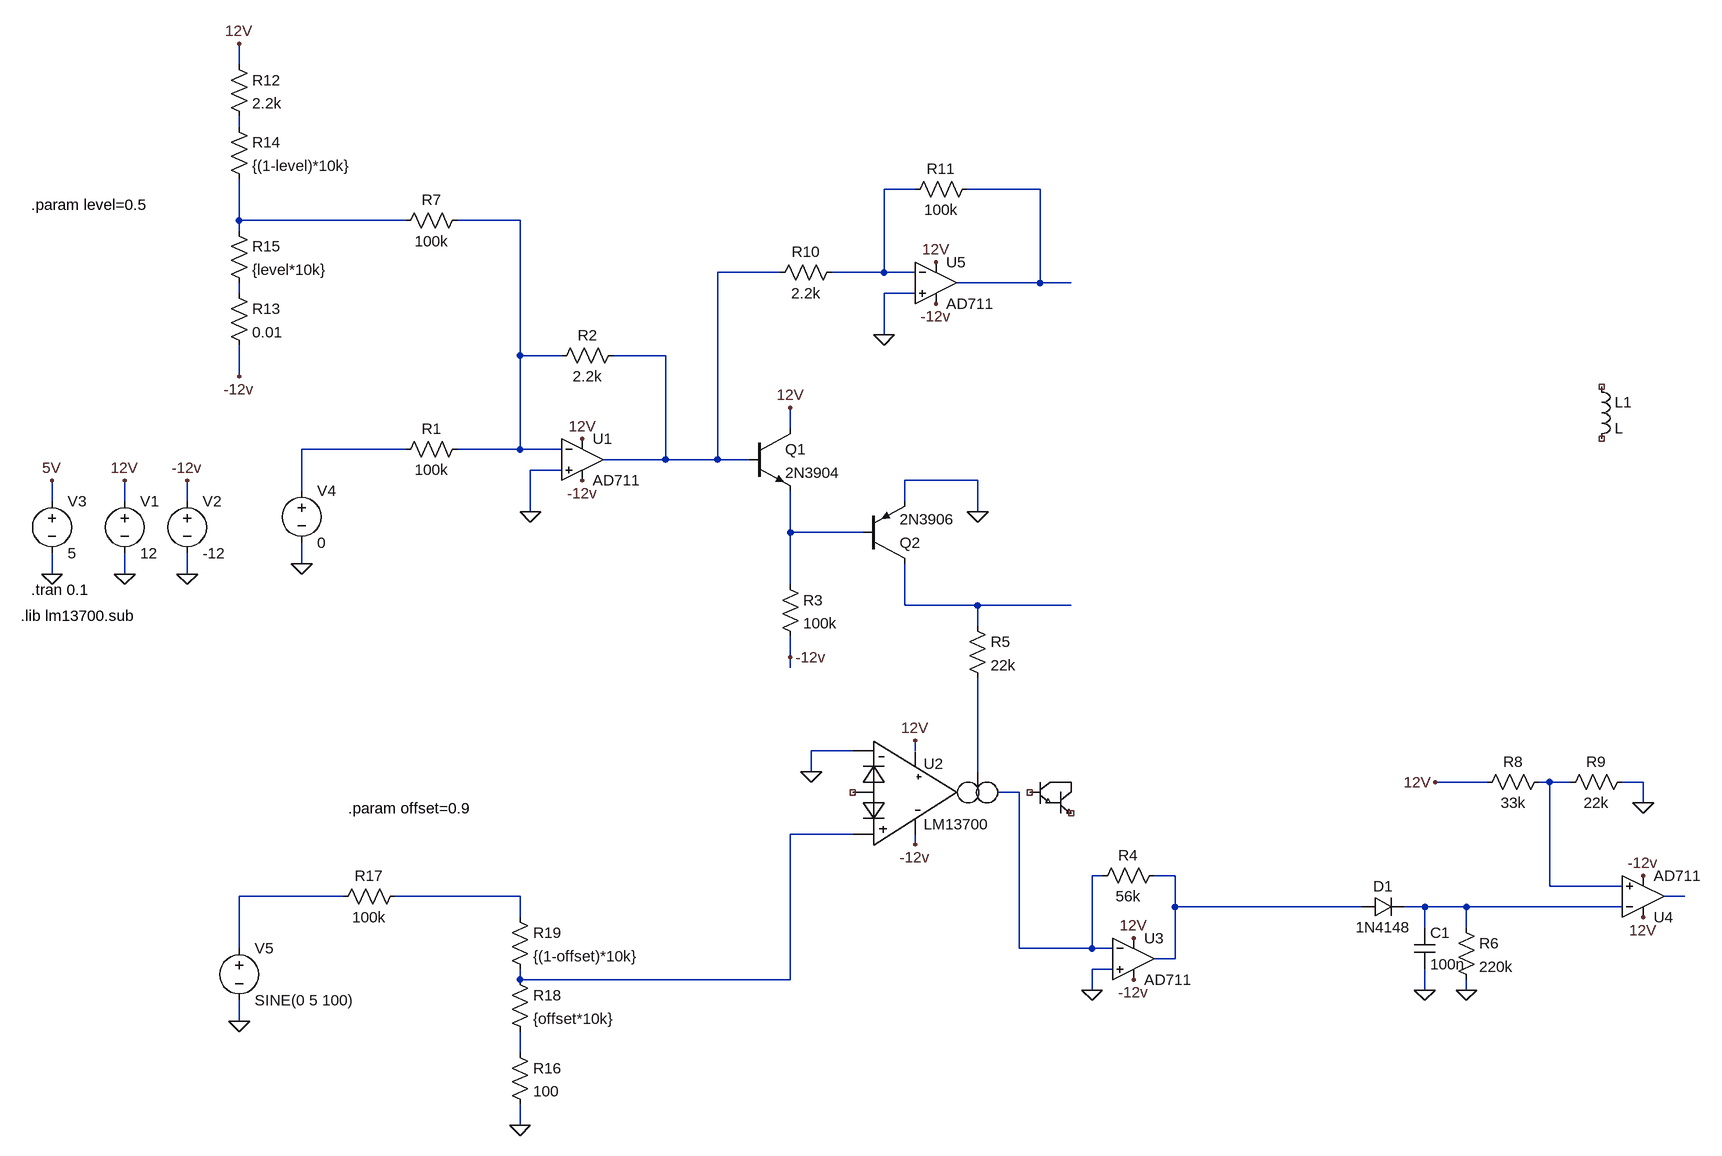
[diagram p0: schematic 404 OTA.asc]
404 OTA.asc, the LTspice schematic file:
Version 4.1
SHEET 1 880 1220
WIRE -2064 -432 -2064 -464
WIRE -2064 -336 -2064 -352
WIRE -1024 -240 -1072 -240
WIRE -832 -240 -944 -240
WIRE -2064 -192 -2064 -256
WIRE -1808 -192 -2064 -192
WIRE -1632 -192 -1728 -192
WIRE -2064 -176 -2064 -192
WIRE -1232 -112 -1328 -112
WIRE -1072 -112 -1072 -240
WIRE -1072 -112 -1152 -112
WIRE -1024 -112 -1072 -112
WIRE -832 -96 -832 -240
WIRE -832 -96 -960 -96
WIRE -784 -96 -832 -96
WIRE -2064 -80 -2064 -96
WIRE -1024 -80 -1072 -80
WIRE -1072 -16 -1072 -80
WIRE -1632 16 -1632 -192
WIRE -1568 16 -1632 16
WIRE -1408 16 -1488 16
WIRE -2064 48 -2064 0
WIRE -1216 128 -1216 96
WIRE -1808 160 -1968 160
WIRE -1632 160 -1632 16
WIRE -1632 160 -1728 160
WIRE -1568 160 -1632 160
WIRE -1408 176 -1408 16
WIRE -1408 176 -1504 176
WIRE -1328 176 -1328 -112
WIRE -1328 176 -1408 176
WIRE -1280 176 -1328 176
WIRE -1568 192 -1616 192
WIRE -928 208 -1040 208
WIRE -1968 224 -1968 160
WIRE -2352 240 -2352 208
WIRE -2240 240 -2240 208
WIRE -2144 240 -2144 208
WIRE -1040 240 -1040 208
WIRE -1616 256 -1616 192
WIRE -928 256 -928 208
WIRE -1216 288 -1216 224
WIRE -1104 288 -1216 288
WIRE -1968 336 -1968 304
WIRE -2352 352 -2352 320
WIRE -2240 352 -2240 320
WIRE -2144 352 -2144 320
WIRE -1216 368 -1216 288
WIRE -1040 400 -1040 336
WIRE -928 400 -1040 400
WIRE -784 400 -928 400
WIRE -928 432 -928 400
WIRE -1216 480 -1216 448
WIRE -1216 496 -1216 480
WIRE -1120 624 -1184 624
WIRE -1024 624 -1024 608
WIRE -1184 656 -1184 624
WIRE -928 656 -928 512
WIRE -144 672 -224 672
WIRE -48 672 -64 672
WIRE -16 672 -48 672
WIRE 96 672 64 672
WIRE -864 688 -896 688
WIRE 96 704 96 672
WIRE -1120 752 -1216 752
WIRE -1024 768 -1024 752
WIRE -736 816 -752 816
WIRE -624 816 -656 816
WIRE -48 832 -48 672
WIRE 64 832 -48 832
WIRE -1904 848 -2064 848
WIRE -1632 848 -1824 848
WIRE 160 848 128 848
WIRE -624 864 -624 816
WIRE -336 864 -624 864
WIRE -240 864 -272 864
WIRE -176 864 -240 864
WIRE 64 864 -176 864
WIRE -1632 880 -1632 848
WIRE -240 896 -240 864
WIRE -176 896 -176 864
WIRE -2064 928 -2064 848
WIRE -864 928 -864 688
WIRE -752 928 -752 816
WIRE -752 928 -864 928
WIRE -720 928 -752 928
WIRE -624 944 -624 864
WIRE -624 944 -656 944
WIRE -720 960 -752 960
WIRE -1632 976 -1632 960
WIRE -1216 976 -1216 752
WIRE -1216 976 -1632 976
WIRE -752 992 -752 960
WIRE -240 992 -240 960
WIRE -176 992 -176 976
WIRE -2064 1040 -2064 1008
WIRE -1632 1088 -1632 1056
WIRE -1632 1200 -1632 1168
FLAG -1536 208 -12v
FLAG -1536 144 12V
FLAG -2240 352 0
FLAG -2240 208 12V
FLAG -2144 352 0
FLAG -2144 208 -12v
FLAG -2352 352 0
FLAG -2352 208 5V
FLAG -1968 336 0
FLAG -1024 608 12V
FLAG -1024 768 -12v
FLAG -2064 1040 0
FLAG -688 976 -12v
FLAG -688 912 12V
FLAG -752 992 0
FLAG -928 256 0
FLAG -1216 480 -12v
FLAG -1216 96 12V
FLAG -1616 256 0
FLAG 96 816 -12v
FLAG 96 880 12V
FLAG -240 992 0
FLAG -176 992 0
FLAG 96 704 0
FLAG -224 672 12V
FLAG -992 -64 -12v
FLAG -992 -128 12V
FLAG -1072 -16 0
FLAG -2064 48 -12v
FLAG -2064 -464 12V
FLAG -1184 656 0
FLAG -1632 1200 0
SYMBOL OpAmps\\AD711 -1536 112 R0
SYMATTR InstName U1
SYMBOL voltage -2240 224 R0
WINDOW 123 0 0 Left 0
WINDOW 39 0 0 Left 0
SYMATTR InstName V1
SYMATTR Value 12
SYMBOL voltage -2144 224 R0
WINDOW 123 0 0 Left 0
WINDOW 39 0 0 Left 0
SYMATTR InstName V2
SYMATTR Value -12
SYMBOL voltage -2352 224 R0
WINDOW 123 0 0 Left 0
WINDOW 39 0 0 Left 0
SYMATTR InstName V3
SYMATTR Value 5
SYMBOL voltage -1968 208 R0
WINDOW 123 0 0 Left 0
WINDOW 39 0 0 Left 0
SYMATTR InstName V4
SYMATTR Value 0
SYMBOL res -1712 144 R90
WINDOW 0 0 56 VBottom 2
WINDOW 3 32 56 VTop 2
SYMATTR InstName R1
SYMATTR Value 100k
SYMBOL res -1472 0 R90
WINDOW 0 0 56 VBottom 2
WINDOW 3 32 56 VTop 2
SYMATTR InstName R2
SYMATTR Value 2.2k
SYMBOL LM13700 -1056 608 R0
SYMATTR InstName U2
SYMBOL voltage -2064 912 R0
WINDOW 123 0 0 Left 0
WINDOW 39 0 0 Left 0
SYMATTR InstName V5
SYMATTR Value SINE(0 5 100)
SYMBOL OpAmps\\AD711 -688 880 R0
SYMATTR InstName U3
SYMBOL res -1712 -208 R90
WINDOW 0 0 56 VBottom 2
WINDOW 3 32 56 VTop 2
SYMATTR InstName R7
SYMATTR Value 100k
SYMBOL npn -1280 128 R0
SYMATTR InstName Q1
SYMATTR Value 2N3904
SYMBOL pnp -1104 336 M180
SYMATTR InstName Q2
SYMATTR Value 2N3906
SYMBOL res -1232 352 R0
SYMATTR InstName R3
SYMATTR Value 100k
SYMBOL res -944 416 R0
SYMATTR InstName R5
SYMATTR Value 22k
SYMBOL OpAmps\\AD711 96 912 M180
SYMATTR InstName U4
SYMBOL diode -336 880 R270
WINDOW 0 32 32 VTop 2
WINDOW 3 0 32 VBottom 2
SYMATTR InstName D1
SYMATTR Value 1N4148
SYMBOL cap -256 896 R0
SYMATTR InstName C1
SYMATTR Value 100n
SYMBOL res -192 880 R0
SYMATTR InstName R6
SYMATTR Value 220k
SYMBOL res -48 656 R90
WINDOW 0 0 56 VBottom 2
WINDOW 3 32 56 VTop 2
SYMATTR InstName R8
SYMATTR Value 33k
SYMBOL res -32 688 R270
WINDOW 0 32 56 VTop 2
WINDOW 3 0 56 VBottom 2
SYMATTR InstName R9
SYMATTR Value 22k
SYMBOL OpAmps\\AD711 -992 -160 R0
SYMATTR InstName U5
SYMBOL res -1136 -128 R90
WINDOW 0 0 56 VBottom 2
WINDOW 3 32 56 VTop 2
SYMATTR InstName R10
SYMATTR Value 2.2k
SYMBOL res -928 -256 R90
WINDOW 0 0 56 VBottom 2
WINDOW 3 32 56 VTop 2
SYMATTR InstName R11
SYMATTR Value 100k
SYMBOL res -2080 -448 R0
SYMATTR InstName R12
SYMATTR Value 2.2k
SYMBOL res -2080 -96 R0
SYMATTR InstName R13
SYMATTR Value 0.01
SYMBOL res -2080 -352 R0
SYMATTR InstName R14
SYMATTR Value {(1-level)*10k}
SYMBOL res -2080 -192 R0
SYMATTR InstName R15
SYMATTR Value {level*10k}
SYMBOL res -1808 832 R90
WINDOW 0 0 56 VBottom 2
WINDOW 3 32 56 VTop 2
SYMATTR InstName R17
SYMATTR Value 100k
SYMBOL res -1648 960 R0
SYMATTR InstName R18
SYMATTR Value {offset*10k}
SYMBOL res -1648 864 R0
SYMATTR InstName R19
SYMATTR Value {(1-offset)*10k}
SYMBOL res -1648 1072 R0
SYMATTR InstName R16
SYMATTR Value 100
SYMBOL res -752 832 R270
WINDOW 0 32 56 VTop 2
WINDOW 3 0 56 VBottom 2
SYMATTR InstName R4
SYMATTR Value 56k
SYMBOL ind 16 48 R0
SYMATTR InstName L1
TEXT -2384 376 Left 2 !.tran 0.1
TEXT -2400 416 Left 2 !.lib lm13700.sub
TEXT -2384 -216 Left 2 !.param level=0.5
TEXT -1896 712 Left 2 !.param offset=0.9

The netlist it stands for:
* 404 OTA.asc
X§U1 0 N005 12V -12v N006 AD712  ; AD711, pins In+ In- V+ V- OUT
V1 12V 0 12
V2 -12v 0 -12
V3 5V 0 5
V4 N008 0 0
R1 N005 N008 100k
R2 N006 N005 2.2k
X§U2 NC_01 N014 0 N011 N013 12V -12v NC_02 NC_03 LM13700 HALF13700  ; pins LIN INP INN IAB ? VCC VSS BIN BUF
V5 N016 0 SINE(0 5 100)
X§U3 0 N013 12V -12v N015 AD712  ; AD711, pins In+ In- V+ V- OUT
R7 N005 N004 100k
Q1 12V N006 N009 0 2N3904
Q2 N010 N009 0 0 2N3906
R3 N009 -12v 100k
R5 N010 N011 22k
X§U4 N012 N019 12V -12v N018 AD712  ; AD711, pins In+ In- V+ V- OUT
D1 N015 N019 1N4148
C1 N019 0 100n
R6 N019 0 220k
R8 N012 12V 33k
R9 N012 0 22k
X§U5 0 N002 12V -12v N003 AD712  ; AD711, pins In+ In- V+ V- OUT
R10 N002 N006 2.2k
R11 N003 N002 100k
R12 12V N001 2.2k
R13 N007 -12v 0.01
R14 N001 N004 {(1-level)*10k}
R15 N004 N007 {level*10k}
R17 N017 N016 100k
R18 N014 N020 {offset*10k}
R19 N017 N014 {(1-offset)*10k}
R16 N020 0 100
R4 N013 N015 56k
L1 NC_04 NC_05 L
.model D D
.lib standard.dio
.model NPN NPN
.model PNP PNP
.lib standard.bjt
.tran 0.1
.lib lm13700.sub
.param level=0.5
.param offset=0.9
.lib ADI1.lib
.backanno
.end